# EAGLE design AstrohawkII (EAGLE 8.2.2)
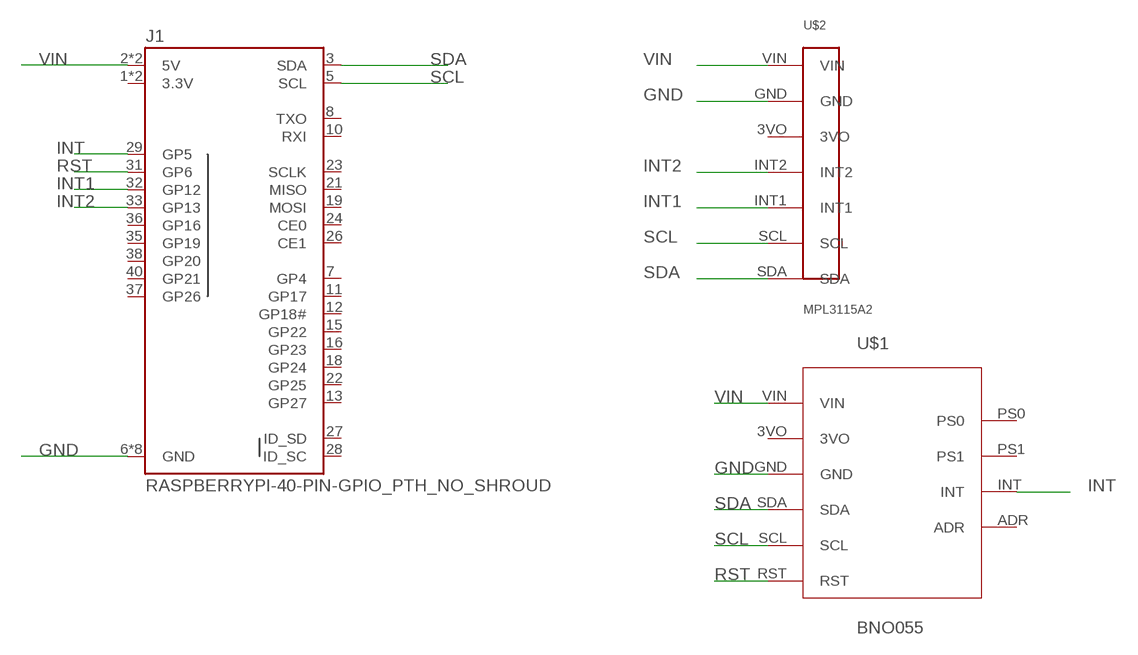
[diagram p0: schematic, sheet 1]

## Parts
J1  RASPBERRYPI-40-PIN-GPIO_PTH_NO_SHROUD  [2X20]
U$1  BNO055  [BNO055]
U$2  MPL3115A2  [MPL3115A2]

## Nets
GND: J1.6(GND) J1.9(GND) J1.14(GND) J1.20(GND) J1.25(GND) J1.30(GND) J1.34(GND) J1.39(GND) U$1.GND U$2.GND
INT: J1.29(GP5) U$1.INT
INT1: J1.32(GP12) U$2.INT1
INT2: J1.33(GP13) U$2.INT2
RST: J1.31(GP6) U$1.RST
SCL: J1.5(SCL) U$1.SCL U$2.SCL
SDA: J1.3(SDA) U$1.SDA U$2.SDA
VIN: J1.2(5V) J1.4(5V) U$1.VIN U$2.VIN
Unconnected: J1.7(GP4) J1.8(TXO) J1.10(RXI) J1.11(GP17) J1.12(GP18#) J1.13(GP27) J1.15(GP22) J1.16(GP23) J1.18(GP24) J1.19(MOSI) J1.21(MISO) J1.22(GP25) J1.23(SCLK) J1.24(CE0) J1.26(CE1) J1.27(ID_SD) J1.28(ID_SC) J1.35(GP19) J1.36(GP16) J1.37(GP26) J1.38(GP20) J1.40(GP21) U$1.3VO U$1.ADR U$1.PS0 U$1.PS1 U$2.3VO

## Power pins joined to a net without a drawn wire
3.3V: J1.1(3.3V) J1.17(3.3V)

## Library data of the parts
J1 = SparkFun-Connectors:RASPBERRYPI-40-PIN-GPIO: Raspberry Pi GPIO Header 2x20 pin connector, as found on B, B+, A+ models. Both shrouded PTH and SMT versions available. SparkFun Products: GPIO Shrouded Header <https://www.sparkfun.com/products/13054>- PTH SparkFun Pi Wedge (Preassembled) <https://www.sparkfun.com/products/13717>
U$1 = rocketry:BNO055
U$2 = rocketry:MPL3115A2

## Board
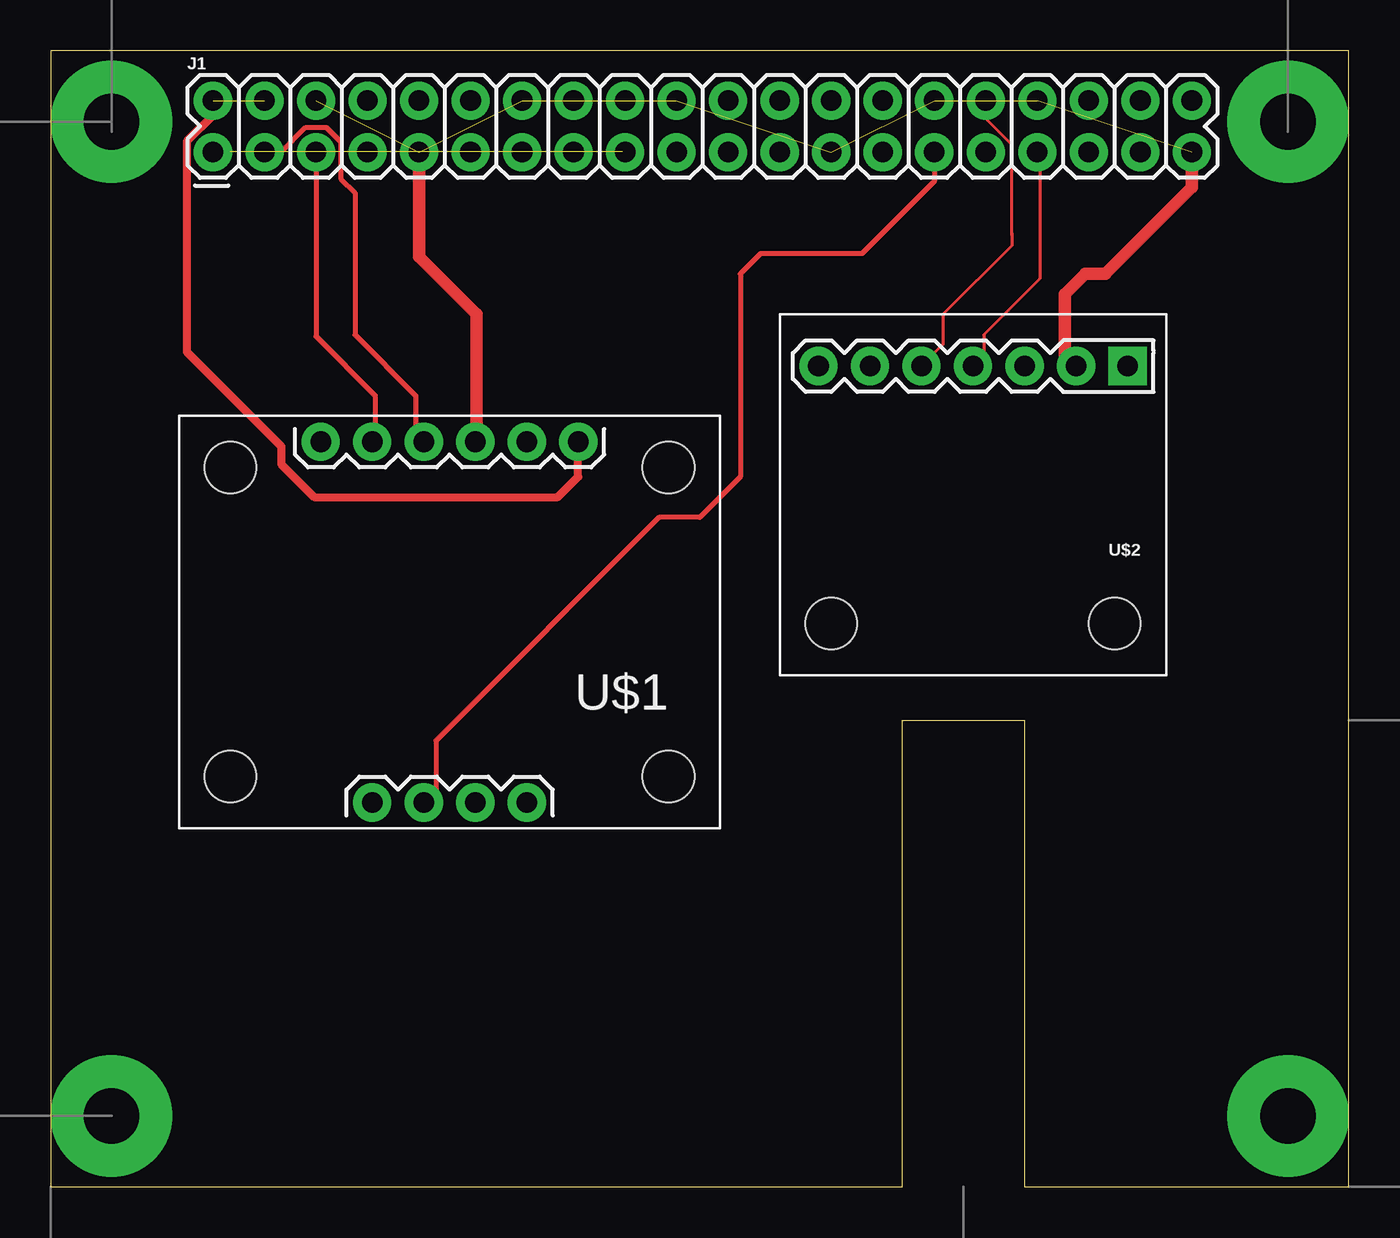
[diagram p1: board, top side]
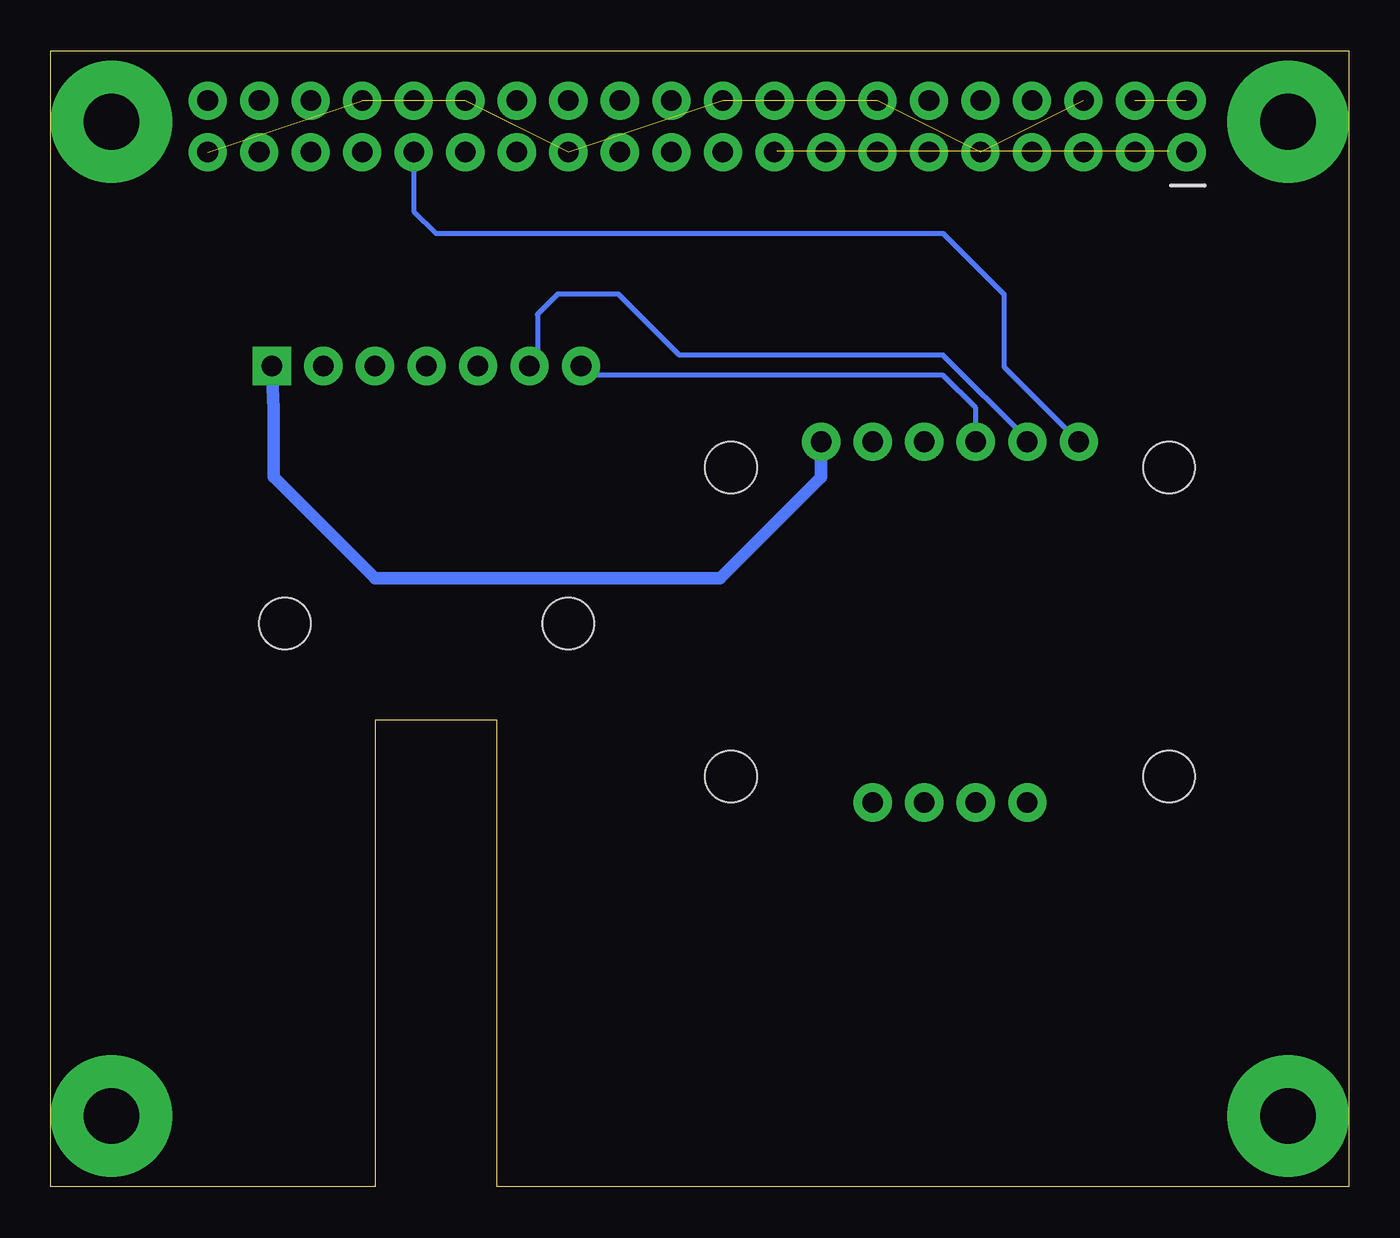
[diagram p2: board, bottom side, seen from below]

Size 64 x 56 mm. Coordinates in mm from the lower left corner, seen from the top.
Outline: 0,0 42,0 42,23 48,23 48,0 64,0 64,56 0,56 0,0
Copper layers (1*16): Top 0.035mm / dielectric 1.5mm / Bottom 0.035mm
Design rules "default": minimum track width 6mil, minimum drill 0.35mm, track to track 6mil, track to pad 6mil, pad to pad 6mil, via to via 6mil, smd to smd 6mil, copper to edge 40mil, drill to drill 6mil, minimum pad ring 10mil, minimum via ring 8mil, stop-mask expansion 4mil, vias tented up to drill 0mil, thermal gap 10mil

### Footprints (pad centres in the part's own frame; a part is rotated, then mirrored left to right if it is on the bottom)
2X20 = drill 1.016 pad 1.88: 1 0,0; 2 0,2.54; 3 2.54,0; 4 2.54,2.54; 5 5.08,0; 6 5.08,2.54; 7 7.62,0; 8 7.62,2.54; 9 10.16,0; 10 10.16,2.54; 11 12.7,0; 12 12.7,2.54; 13 15.24,0; 14 15.24,2.54; 15 17.78,0; 16 17.78,2.54; 17 20.32,0; 18 20.32,2.54; 19 22.86,0; 20 22.86,2.54; 21 25.4,0; 22 25.4,2.54; 23 27.94,0; 24 27.94,2.54; 25 30.48,0; 26 30.48,2.54; 27 33.02,0; 28 33.02,2.54; 29 35.56,0; 30 35.56,2.54; 31 38.1,0; 32 38.1,2.54; 33 40.64,0; 34 40.64,2.54; 35 43.18,0; 36 43.18,2.54; 37 45.72,0; 38 45.72,2.54; 39 48.26,0; 40 48.26,2.54
BNO055 = drill 1.016 pad 1.88: 3VO 9.525,1.27; ADR 17.145,19.05; GND 12.065,1.27; INT 14.605,19.05; PS0 9.525,19.05; PS1 12.065,19.05; RST 19.685,1.27; SCL 17.145,1.27; SDA 14.605,1.27; VIN 6.985,1.27 | hole 2.54: 2.54,17.78; 2.54,2.54; 24.13,2.54; 24.13,17.78
MPL3115A2 = drill 1.016 pad 1.88: 3VO 6.985,2.54; GND 4.445,2.54; INT1 12.065,2.54; INT2 9.525,2.54; SCL 14.605,2.54; SDA 17.145,2.54 | drill 1.016 pad 1.88 square: VIN 1.905,2.54 | hole 2.54: 2.54,15.24; 16.51,15.24

### Placement (x,y rotation side)
J1  8,51 0 top
U$1  33,38 180 top
U$2  55,43 180 top

### Tracks (layer width: path | path; a pad name or v marks a point on that pad's centre or on a via)
3.3V  (1 unrouted)
  Bottom 0.152: 8.84,51.05 8.08,51.05 J1.1 | 28.19,51.05 J1.17
GND  (7 unrouted)
  Top 0.61: J1.9 18.16,45.84 21,43 21,36.8 U$1.GND | J1.39 56.26,49.26 52,45 51,45 50,44 50,41.02 U$2.GND
INT
  Top 0.254: J1.29 43.56,49.56 40,46 35,46 34,45 34,35 32,33 30,33 19,22 19,19.55 U$1.INT
INT1
  Top 0.152: 47.4,46.88 47.4,47 | 47.4,47 47.4,51.36 46.18,52.58 46.18,53.49 J1.32 | 47.4,47 47.4,46.4 44,43 44,41.52 U$2.INT1
INT2
  Top 0.152: J1.33 48.77,50.9 48.77,44.77 46,42 46,40.98 U$2.INT2
N$1  (via drill 2.75 pad 6)
  other vias: 3,52.5
N$2  (via drill 2.75 pad 6)
  other vias: 3,3.5
N$3  (via drill 2.75 pad 6)
  other vias: 61,3.5
N$4  (via drill 2.75 pad 6)
  other vias: 61,52.5
RST
  Bottom 0.254: J1.31 46.1,48.1 45,47 20,47 17,44 17,40.41 U$1.RST
SCL
  Top 0.254: J1.5 13.08,41.92 16,39 16,36.88 U$1.SCL
  Bottom 0.152: 12.95,50.9 J1.5 | 16,36.73 U$1.SCL
  Bottom 0.254: U$1.SCL 15.86,36.85 20,41 33,41 36,44 39,44 40,43 40,40.85 U$2.SCL
SDA
  Top 0.254: J1.3 11.36,51 12.57,52.22 13.59,52.22 14.3,51.51 14.3,49.7 15,49 15,42 18,39 18,37.12 U$1.SDA
  Bottom 0.152: 18.44,36.73 U$1.SDA
  Bottom 0.254: U$1.SDA 18.39,38.4 20,40 37.4,40 U$2.SDA
VIN  (1 unrouted)
  Top 0.406: J1.2 8,52.83 6.71,51.54 6.71,41.16 11.37,36.5 11.37,35.63 13,34 25,34 26,35 26,36.72 U$1.VIN
  Bottom 0.152: 26.06,36.88 U$1.VIN
  Bottom 0.61: U$1.VIN 26.02,34.98 31,30 48,30 53,35 53,38.37 U$2.VIN